# Altium project Ultra_CAP.PrjPcb
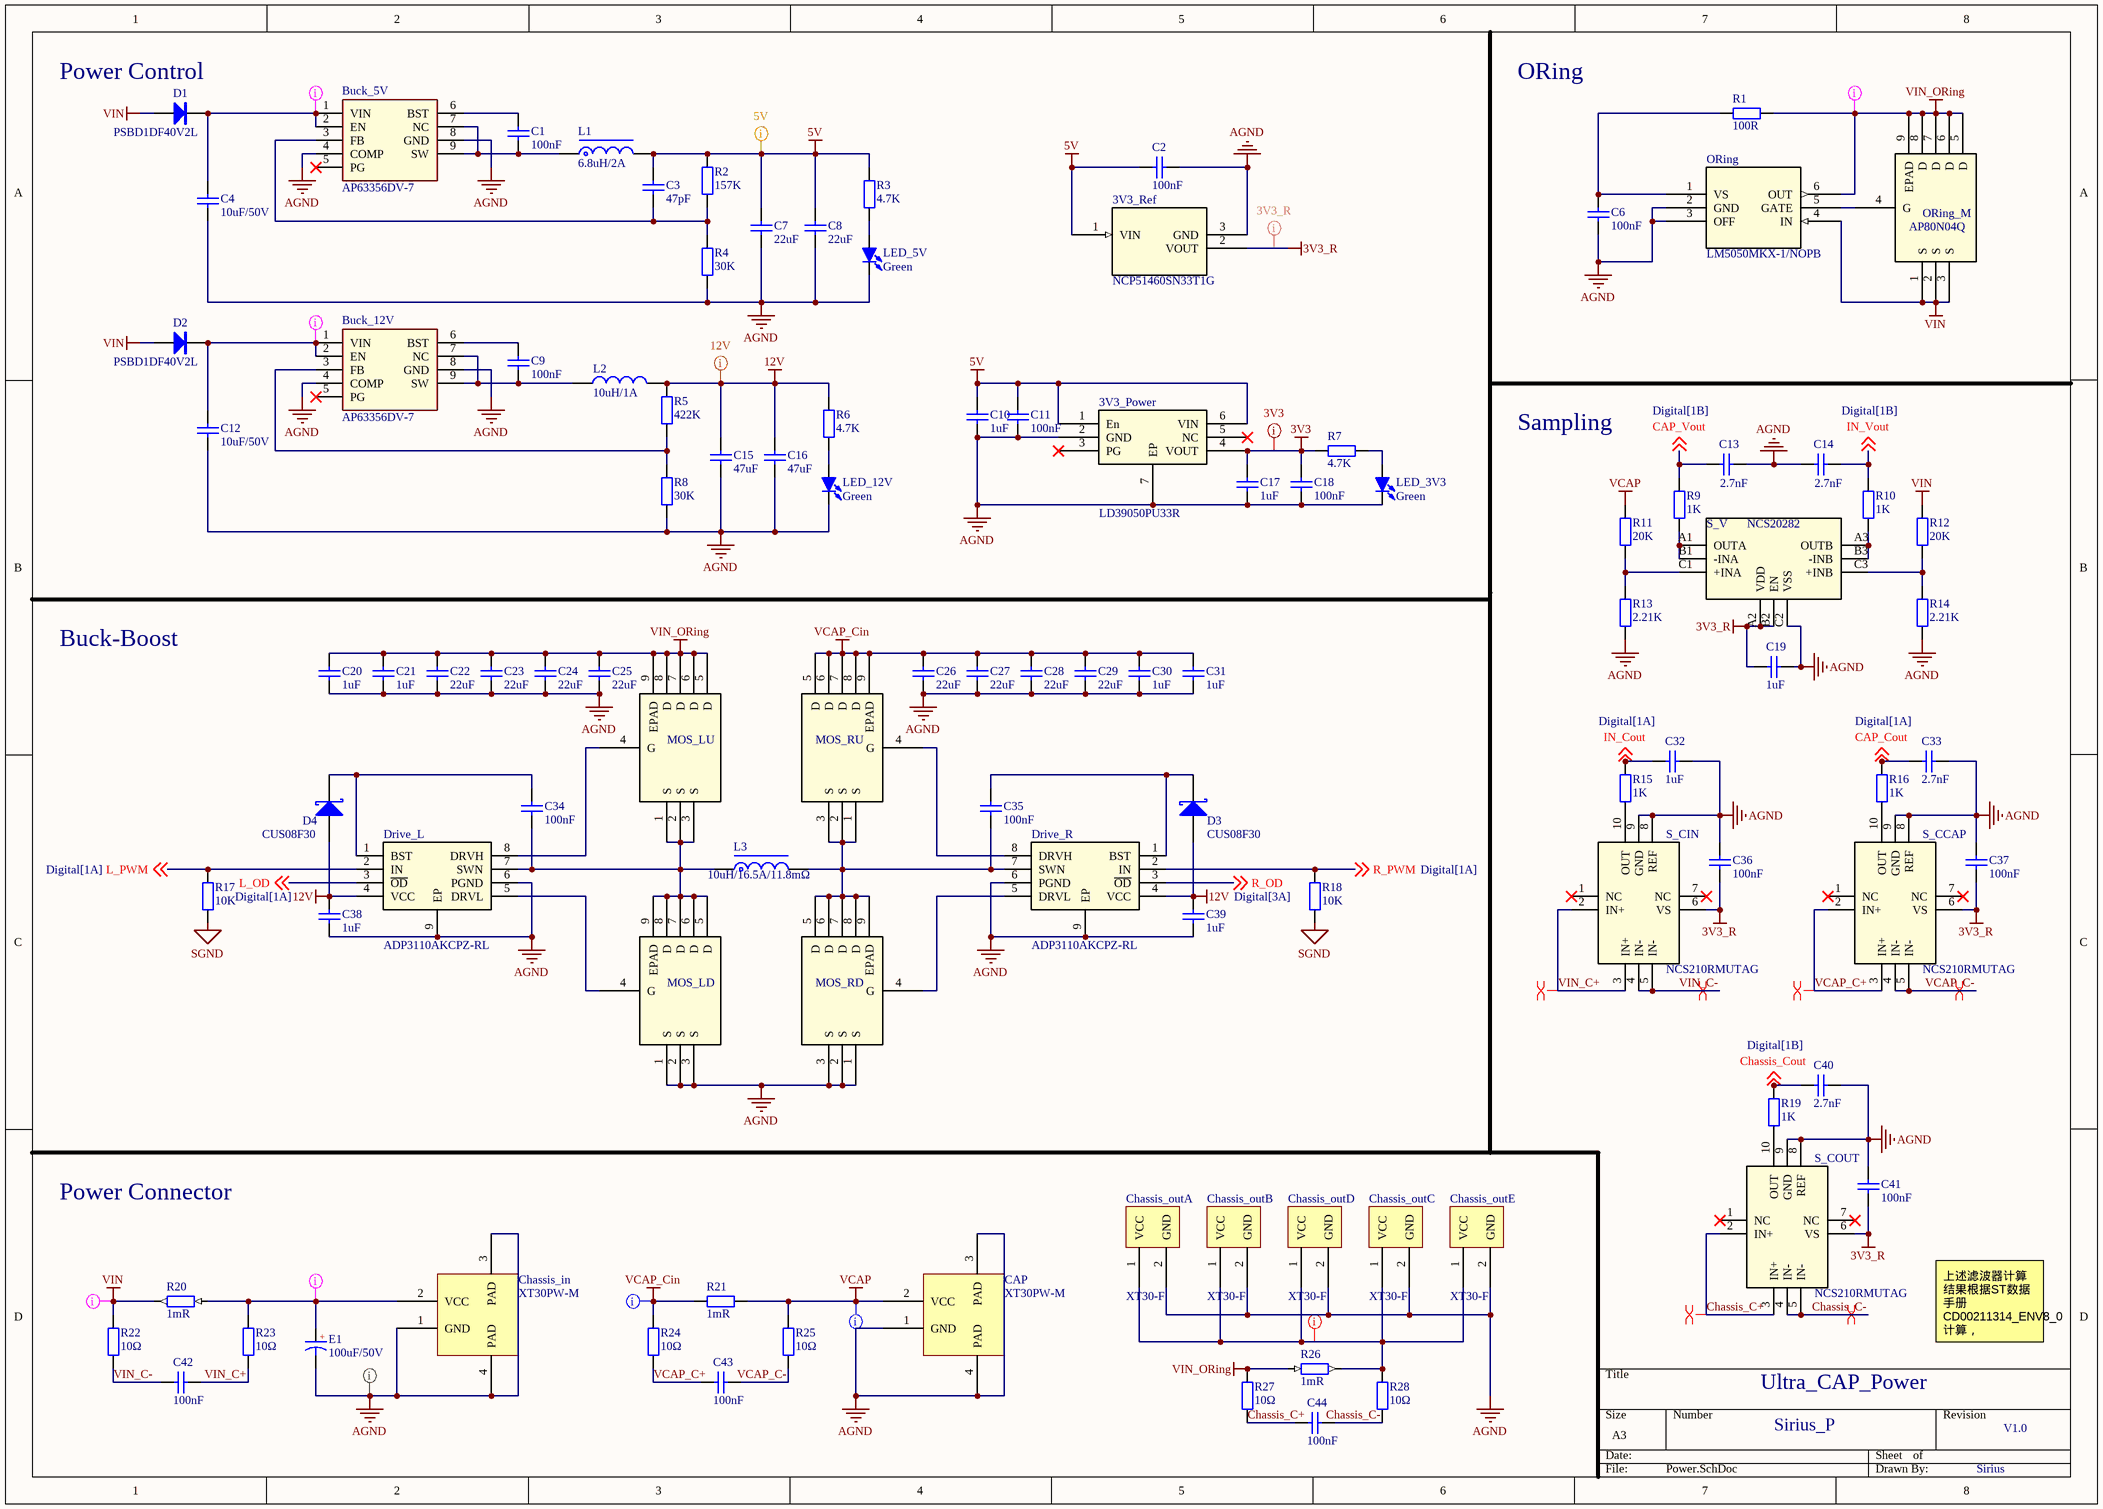
[diagram p0: Power.SchDoc]
2 sheets, 183 parts. Net scope: global (net labels, ports and power ports of the same name join across sheets).
Board file: Ultra_CAP.PcbDoc
Sheets:
  Power.SchDoc
  Digital.SchDoc

## Sheet Power.SchDoc
size A3; SheetNumber: 1; SheetTotal: 2

### Parts
3V3_Power  LD39050PU33R  [SON_DFN6_3X3_STM-L]
3V3_Ref  NCP51460SN33T1G  [SOT23]
Buck_5V  AP63356DV-7  [AP63356DV7]
Buck_12V  AP63356DV-7  [AP63356DV7]
C1  100nF  [C0603_L]
C2  100nF  [C0603_L]
C3  47pF  [C0603_L]
C4  10uF/50V  [C0603_L]
C6  100nF  [C0603_L]
C7  22uF  [C1210_L]
C8  22uF  [C1210_L]
C9  100nF  [C0603_L]
C10  1uF  [C0603_L]
C11  100nF  [C0603_L]
C12  10uF/50V  [C0603_L]
C13  2.7nF  [C0603_L]
C14  2.7nF  [C0603_L]
C15  47uF  [C1206_L]
C16  47uF  [C1206_L]
C17  1uF  [C0603_L]
C18  100nF  [C0603_L]
C19  1uF  [C0603_L]
C20  1uF  [C0603_L]
C21  1uF  [C0603_L]
C22  22uF  [C2220_no overlay]
C23  22uF  [C2220_no overlay]
C24  22uF  [C2220_no overlay]
C25  22uF  [C2220_no overlay]
C26  22uF  [C2220_no overlay]
C27  22uF  [C2220_no overlay]
C28  22uF  [C2220_no overlay]
C29  22uF  [C2220_no overlay]
C30  1uF  [C0603_L]
C31  1uF  [C0603_L]
C32  1uF  [C0603_L]
C33  2.7nF  [C0603_L]
C34  100nF  [C0603_L]
C35  100nF  [C0603_L]
C36  100nF  [C0603_L]
C37  100nF  [C0603_L]
C38  1uF  [C0603_L]
C39  1uF  [C0603_L]
C40  2.7nF  [C0603_L]
C41  100nF  [C0603_L]
C42  100nF  [C0603_L]
C43  100nF  [C0603_L]
C44  100nF  [C0603_L]
CAP  XT30PW-M  [CONN-TH_XT30PW-M]
Chassis_in  XT30PW-M  [CONN-TH_XT30PW-M]
Chassis_outA  XT30-F  [XT30-F]
Chassis_outB  XT30-F  [XT30-F]
Chassis_outC  XT30-F  [XT30-F]
Chassis_outD  XT30-F  [XT30-F]
Chassis_outE  XT30-F  [XT30-F]
D1  PSBD1DF40V2L  [SOD-123]
D2  PSBD1DF40V2L  [SOD-123]
D3  CUS08F30  [SOD-323]
D4  CUS08F30  [SOD-323]
Drive_L  ADP3110AKCPZ-RL  [SON50P300X300X100-9N]
Drive_R  ADP3110AKCPZ-RL  [SON50P300X300X100-9N]
E1  100uF/50V  [CT 3.5*8*8 - R]
L1  6.8uH/2A  [L-SMD-0420]
L2  10uH/1A  [L1210]
L3  10uH/16.5A/11.8mΩ  [INDPM176169X700N]
LED_3V3  Green  [LED0603_G]
LED_5V  Green  [LED0603_G]
LED_12V  Green  [LED0603_G]
MOS_LD  HYG025N06LS1C2  [PDFN5*6-8l]  (value not drawn)
MOS_LU  HYG025N06LS1C2  [PDFN5*6-8l]  (value not drawn)
MOS_RD  HYG025N06LS1C2  [PDFN5*6-8l]  (value not drawn)
MOS_RU  HYG025N06LS1C2  [PDFN5*6-8l]  (value not drawn)
ORing  LM5050MKX-1/NOPB  [SOT23-6]
ORing_M  AP80N04Q  [TDFN33-8]
R1  100R  [R0603_L]
R2  157K  [R0603_L]
R3  4.7K  [R0603_L]
R4  30K  [R0603_L]
R5  422K  [R0603_L]
R6  4.7K  [R0603_L]
R7  4.7K  [R0603_L]
R8  30K  [R0603_L]
R9  1K  [R0603_L]
R10  1K  [R0603_L]
R11  20K  [R0603_L]
R12  20K  [R0603_L]
R13  2.21K  [R0603_L]
R14  2.21K  [R0603_L]
R15  1K  [R0603_L]
R16  1K  [R0603_L]
R17  10K  [R0603_L]
R18  10K  [R0603_L]
R19  1K  [R0603_L]
R20  1mR  [R2512_L]
R21  1mR  [R2512_L]
R22  10Ω  [R0603_L]
R23  10Ω  [R0603_L]
R24  10Ω  [R0603_L]
R25  10Ω  [R0603_L]
R26  1mR  [R2512_L]
R27  10Ω  [R0603_L]
R28  10Ω  [R0603_L]
S_CCAP  NCS210RMUTAG  [QFN40P140X180X60-10N]
S_CIN  NCS210RMUTAG  [QFN40P140X180X60-10N]
S_COUT  NCS210RMUTAG  [QFN40P140X180X60-10N]
S_V  NCS20282  [BGA9C40P3X3_122X122X62]

### Nets
3V3: 3V3_Power.4(VOUT) C17.2 C18.2 R7.2
3V3_R: 3V3_Ref.2(VOUT) C19.2 C36.1 C37.1 C41.1 S_CCAP.6(VS) S_CIN.6(VS) S_COUT.6(VS) S_V.A2(VDD) S_V.B2(EN)
5V: 3V3_Power.1(En) 3V3_Power.6(VIN) 3V3_Ref.1(VIN) C2.2 C3.2 C7.2 C8.2 C10.2 C11.2 L1.2 R2.2 R3.2
12V: C15.2 C16.2 C38.1 C39.1 D3.1(A) D4.1(A) Drive_L.4(VCC) Drive_R.4(VCC) L2.2 R5.2 R6.2
AGND: 3V3_Power.2(GND) 3V3_Power.7(EP) 3V3_Ref.3(GND) Buck_5V.4(COMP) Buck_5V.8(GND) Buck_12V.4(COMP) Buck_12V.8(GND) C2.1 C4.1 C6.1 C7.1 C8.1 C10.1 C11.1 C12.1 C13.2 C14.1 C15.1 C16.1 C17.1 C18.1 C19.1 C20.1 C21.1 C22.1 C23.1 C24.1 C25.1 C26.1 C27.1 C28.1 C29.1 C30.1 C31.1 C32.2 C33.2 C36.2 C37.2 C38.2 C39.2 C40.2 C41.2 CAP.1(GND) CAP.3(PAD) CAP.4(PAD) Chassis_in.1(GND) Chassis_in.3(PAD) Chassis_in.4(PAD) Chassis_outA.2(GND) Chassis_outB.2(GND) Chassis_outC.2(GND) Chassis_outD.2(GND) Chassis_outE.2(GND) Drive_L.6(PGND) Drive_L.9(EP) Drive_R.6(PGND) Drive_R.9(EP) E1.2 LED_3V3.2(K) LED_5V.2(K) LED_12V.2(K) MOS_LD.1(S) MOS_LD.2(S) MOS_LD.3(S) MOS_RD.1(S) MOS_RD.2(S) MOS_RD.3(S) ORing.2(GND) ORing.3(OFF) R4.1 R8.1 R13.1 R14.1 S_CCAP.8(REF) S_CCAP.9(GND) S_CIN.8(REF) S_CIN.9(GND) S_COUT.8(REF) S_COUT.9(GND) S_V.C2(VSS)
SGND: R17.2 R18.2
VCAP: CAP.2(VCC) R11.1 R21.2 R25.2
VCAP_Cin: C26.2 C27.2 C28.2 C29.2 C30.2 C31.2 MOS_RU.5(D) MOS_RU.6(D) MOS_RU.7(D) MOS_RU.8(D) MOS_RU.9(EPAD) R21.1 R24.2
VIN: D1.1(A) D2.1(A) ORing.4(IN) ORing_M.1(S) ORing_M.2(S) ORing_M.3(S) R12.1 R20.1 R22.2
VIN_ORing: C20.2 C21.2 C22.2 C23.2 C24.2 C25.2 MOS_LU.5(D) MOS_LU.6(D) MOS_LU.7(D) MOS_LU.8(D) MOS_LU.9(EPAD) ORing.6(OUT) ORing_M.5(D) ORing_M.6(D) ORing_M.7(D) ORing_M.8(D) ORing_M.9(EPAD) R1.2 R26.1 R27.1
CAP_Cout: C33.1 R16.1 ; off-sheet CAP_Cout
CAP_Vout: C13.1 R9.1 ; off-sheet CAP_Vout
Chassis_C+: C44.2 R27.2 S_COUT.2(IN+) S_COUT.3(IN+)
Chassis_C-: C44.1 R28.1 S_COUT.4(IN-) S_COUT.5(IN-)
Chassis_Cout: C40.1 R19.1 ; off-sheet Chassis_Cout
IN_Cout: C32.1 R15.1 ; off-sheet IN_Cout
IN_Vout: C14.2 R10.1 ; off-sheet IN_Vout
L_OD: Drive_L.3(~{OD}) ; off-sheet L_OD
L_PWM: Drive_L.2(IN) R17.1 ; off-sheet L_PWM
R_OD: Drive_R.3(~{OD}) ; off-sheet R_OD
R_PWM: Drive_R.2(IN) R18.1 ; off-sheet R_PWM
VCAP_C+: C43.2 R24.1 S_CCAP.2(IN+) S_CCAP.3(IN+)
VCAP_C-: C43.1 R25.1 S_CCAP.4(IN-) S_CCAP.5(IN-)
VIN_C+: C42.1 R23.1 S_CIN.2(IN+) S_CIN.3(IN+)
VIN_C-: C42.2 R22.1 S_CIN.4(IN-) S_CIN.5(IN-)
NetBuck_5V_1: Buck_5V.1(VIN) Buck_5V.2(EN) C4.2 D1.2(K)
NetBuck_5V_3: Buck_5V.3(FB) C3.1 R2.1 R4.2
NetBuck_5V_6: Buck_5V.6(BST) C1.2
NetBuck_5V_7: Buck_5V.7(NC) Buck_5V.9(SW) C1.1 L1.1
NetBuck_12V_1: Buck_12V.1(VIN) Buck_12V.2(EN) C12.2 D2.2(K)
NetBuck_12V_3: Buck_12V.3(FB) R5.1 R8.2
NetBuck_12V_6: Buck_12V.6(BST) C9.2
NetBuck_12V_7: Buck_12V.7(NC) Buck_12V.9(SW) C9.1 L2.1
NetC6_2: C6.2 ORing.1(VS) R1.1
NetC34_1: C34.1 D4.2(K) Drive_L.1(BST)
NetC34_2: C34.2 Drive_L.7(SWN) L3.1 MOS_LD.5(D) MOS_LD.6(D) MOS_LD.7(D) MOS_LD.8(D) MOS_LD.9(EPAD) MOS_LU.1(S) MOS_LU.2(S) MOS_LU.3(S)
NetC35_1: C35.1 D3.2(K) Drive_R.1(BST)
NetC35_2: C35.2 Drive_R.7(SWN) L3.2 MOS_RD.5(D) MOS_RD.6(D) MOS_RD.7(D) MOS_RD.8(D) MOS_RD.9(EPAD) MOS_RU.1(S) MOS_RU.2(S) MOS_RU.3(S)
NetChassis_in_2: Chassis_in.2(VCC) E1.1 R20.2 R23.2
NetChassis_outA_1: Chassis_outA.1(VCC) Chassis_outB.1(VCC) Chassis_outC.1(VCC) Chassis_outD.1(VCC) Chassis_outE.1(VCC) R26.2 R28.2
NetDrive_L_5: Drive_L.5(DRVL) MOS_LD.4(G)
NetDrive_L_8: Drive_L.8(DRVH) MOS_LU.4(G)
NetDrive_R_5: Drive_R.5(DRVL) MOS_RD.4(G)
NetDrive_R_8: Drive_R.8(DRVH) MOS_RU.4(G)
NetLED_3V3_1: LED_3V3.1(A) R7.1
NetLED_5V_1: LED_5V.1(A) R3.1
NetLED_12V_1: LED_12V.1(A) R6.1
NetORing_5: ORing.5(GATE) ORing_M.4(G)
NetR9_2: R9.2 S_V.A1(OUTA) S_V.B1(-INA)
NetR10_2: R10.2 S_V.A3(OUTB) S_V.B3(-INB)
NetR11_2: R11.2 R13.2 S_V.C1(+INA)
NetR12_2: R12.2 R14.2 S_V.C3(+INB)
NetR15_2: R15.2 S_CIN.10(OUT)
NetR16_2: R16.2 S_CCAP.10(OUT)
NetR19_2: R19.2 S_COUT.10(OUT)

Not connected (* = marked no-connect by the designer): 3V3_Power 3(PG)* 5(NC)*; Buck_5V 5(PG)*; Buck_12V 5(PG)*; S_CCAP 1(NC)* 7(NC)*; S_CIN 1(NC)* 7(NC)*; S_COUT 1(NC)* 7(NC)*

### Layout directives
rule Supply Nets [Voltage = 5.000]; net class Power_Class: 5V
rule Supply Nets [Voltage = 3.300]; net class Power_Class: 3V3, 3V3_R
rule Supply Nets [Voltage = 0.000]; net class Power_Class: AGND
rule Supply Nets [Voltage = 24.00]; net class Power_Class: NetBuck_5V_1, NetBuck_12V_1, NetChassis_in_2, VIN, VIN_ORing
rule Supply Nets [Voltage = 23.50]; net class Power_Class: VCAP, VCAP_Cin
rule Supply Nets [Voltage = 12.00]; net class Power_Class: 12V
differential pair: Chassis_C+, Chassis_C-, VCAP_C+, VCAP_C-, VIN_C+, VIN_C-
net class Power_Class: NetChassis_outA_1

### Notes on the sheet
- (near D1) Power Control
- ORing
- Sampling
- Buck-Boost
- Power Connector
- Ultra_CAP_Power
- 上述滤波器计算结果根据ST数据手册CD00211314_ENV8_0计算，FAINmax=37kHz
- Sirius_P
- V1.0
- Sirius
- (in symbol CS) +

### Library data of the parts
3V3_Power = LD39050PU33R: LDO-3V3/500mA
3V3_Ref = NCP51460SN33T1G: 基准电压源3V3; Mfr_Name: onsemi; Copyright: Copyright (C) 2022 Ultra Librarian. All rights reserved.; Manufacturer_Part_Number: NCP51460SN33T1G; RefDes: RefDes; Type: DEV
Buck_5V Buck_12V = AP63356DV-7: Switching Voltage Regulators DCDC Conv HV Buck V-DFN3020-13 T&R 3K 3.8V TO 32V INPUT, 3.5A LOW IQ SYNCHRONOUS BUCK WITH ENHANCED EMI REDUCTION; Manufacturer_Name: Diodes Inc.; Geometry.Height: 0.85mm; Mouser Part Number: 621-AP63356DV-7; Mouser Price/Stock: https://www.mouser.co.uk/ProductDetail/Diodes-Incorporated/AP63356DV-7?qs=bZr6mbWTK5k9UirUfdvjSw%3D%3D; Manufacturer_Part_Number: AP63356DV-7; Datasheet Link: https://www.diodes.com/assets/Datasheets/AP63356-AP63357.pdf
C1-C4 C6-C44 = C: 贴片电容; BOM名称: 无极性贴片电容; 联系卖家，免费查找封装: 唯一出售店铺网址https://shop463601444.taobao.com
D1 D2 = 1N5822: 肖特基二极管; 联系卖家，免费查找封装: 唯一出售店铺网址https://shop463601444.taobao.com; BOM名称: 肖特基二极管
D3 D4 = 1N5819: 肖特基二极管; 联系卖家，免费查找封装: 唯一出售店铺网址https://shop463601444.taobao.com; BOM名称: 肖特基二极管
Drive_L Drive_R = ADP3110AKCPZ-RL: ON SEMICONDUCTOR - ADP3110AKCPZ-RL - MOSFET Driver, High Side And Low Side, 4.6V-13.2V Supply, 1A Out, 20ns Delay, DFN-8; Manufacturer_Name: onsemi; Geometry.Height: 1mm; Manufacturer_Part_Number: ADP3110AKCPZ-RL; Mouser Part Number: 863-ADP3110AKCPZ-RL; Mouser Price/Stock: https://www.mouser.co.uk/ProductDetail/ON-Semiconductor/ADP3110AKCPZ-RL?qs=t2BMfLoP1KSx%2FvThl35SBw%3D%3D; Arrow Part Number: ADP3110AKCPZ-RL; Arrow Price/Stock: https://www.arrow.com/en/products/adp3110akcpz-rl/on-semiconductor; Mouser Testing Part Number: *; Mouser Testing Price/Stock: *; Datasheet Link: http://www.onsemi.com/pub/Collateral/ADP3110A-D.PDF
E1 = CS: 直插固态电容; 联系卖家，免费查找封装: 唯一出售店铺网址https://shop463601444.taobao.com; BOM名称: 直插固态电容
L1 = L-Molding Choke: 一体成型电感; 联系卖家，免费查找封装: 唯一出售店铺网址https://shop463601444.taobao.com; BOM名称: 一体成型电感
L2 = L: 贴片小功率电感; BOM名称: 小功率贴片电感; 联系卖家，免费查找封装: 唯一出售店铺网址https://shop463601444.taobao.com
L3 = L-Molding Choke: 一体成型电感 / TMPC1707HP-100MG-D; 联系卖家，免费查找封装: 唯一出售店铺网址https://shop463601444.taobao.com; BOM名称: 一体成型电感
LED_3V3 LED_5V LED_12V = LED-SMD: 贴片LED; 联系卖家 免费查找封装: 封装库来自淘宝卖家ID：黄晶宝石; BOM名称: 贴片LED
MOS_LD MOS_LU MOS_RD MOS_RU = HYG025N06LS1C2: NMOS 60V/170A; Mfr_Name: Alpha and Omega Semiconductor; Manufacturer_Part_Number: AON7418; Copyright: Copyright (C) 2022 Ultra Librarian. All rights reserved.; RefDes: RefDes; Type: DEV
ORing = LM5050MKX-1/NOPB: 理想二极管控制器; Mfr_Name: Texas Instruments; Copyright: Copyright (C) 2022 Ultra Librarian. All rights reserved.; Manufacturer_Part_Number: LM5050MKX-1/NOPB; RefDes: RefDes; Type: DEV
ORing_M = AP80N04Q: Trans MOSFET N-CH 40V 40A 8-Pin PDFN EP T/R; Manufacturer_Name: Taiwan Semiconductor; Manufacturer_Part_Number: TSM085P03CV RGG; Geometry.Height: 0.75mm; Mouser Part Number: 821-TSM085P03CVRGG; Mouser Price/Stock: https://www.mouser.co.uk/ProductDetail/Taiwan-Semiconductor/TSM085P03CV-RGG?qs=4pzlT8jjbhd4XXSAn%252BJ6qw%3D%3D; Arrow Part Number: TSM085P03CV RGG; Arrow Price/Stock: https://www.arrow.com/en/products/tsm085p03cvrgg/taiwan-semiconductor; Mouser Testing Part Number: *; Mouser Testing Price/Stock: *; Datasheet Link: https://componentsearchengine.com/Datasheets/1/TSM085P03CV RGG.pdf
R1-R28 = R: 贴片电阻; 联系卖家，免费查找封装: 唯一出售店铺网址https://shop463601444.taobao.com; BOM名称: 贴片电阻
S_CCAP S_CIN S_COUT = NCS210RMUTAG: CURRENT SENSE AMP G=200; Manufacturer_Name: onsemi; Geometry.Height: 0.6mm; Manufacturer_Part_Number: NCS210RMUTAG; Mouser Part Number: 863-NCS210RMUTAG; Mouser Price/Stock: https://www.mouser.co.uk/ProductDetail/ON-Semiconductor/NCS210RMUTAG?qs=lYGu3FyN48dPWsNmv2BxUw%3D%3D; Arrow Part Number: NCS210RMUTAG; Arrow Price/Stock: https://www.arrow.com/en/products/ncs210rmutag/on-semiconductor?region=nac; Mouser Testing Part Number: *; Mouser Testing Price/Stock: *; Datasheet Link: http://www.onsemi.com/pub/Collateral/NCS210R-D.PDF
S_V = NCS20282: 7 MHz, 125 A Low Power Operational Amplifier; Manufacturer_Name: onsemi; Manufacturer_Part_Number: FAN48610UC50X; Geometry.Height: 0.619mm; Mouser Part Number: 512-FAN48610UC50X; Mouser Price/Stock: https://www.mouser.co.uk/ProductDetail/ON-Semiconductor-Fairchild/FAN48610UC50X?qs=3SGS%2FGl3GGz6Cj18V%2F7jcA%3D%3D; Arrow Part Number: FAN48610UC50X; Arrow Price/Stock: https://www.arrow.com/en/products/fan48610uc50x/on-semiconductor?region=nac; Mouser Testing Part Number: *; Mouser Testing Price/Stock: *; Datasheet Link: https://www.onsemi.com/pub/Collateral/FAN48610-D.pdf

## Sheet Digital.SchDoc
size A3; SheetNumber: 2; SheetTotal: 2
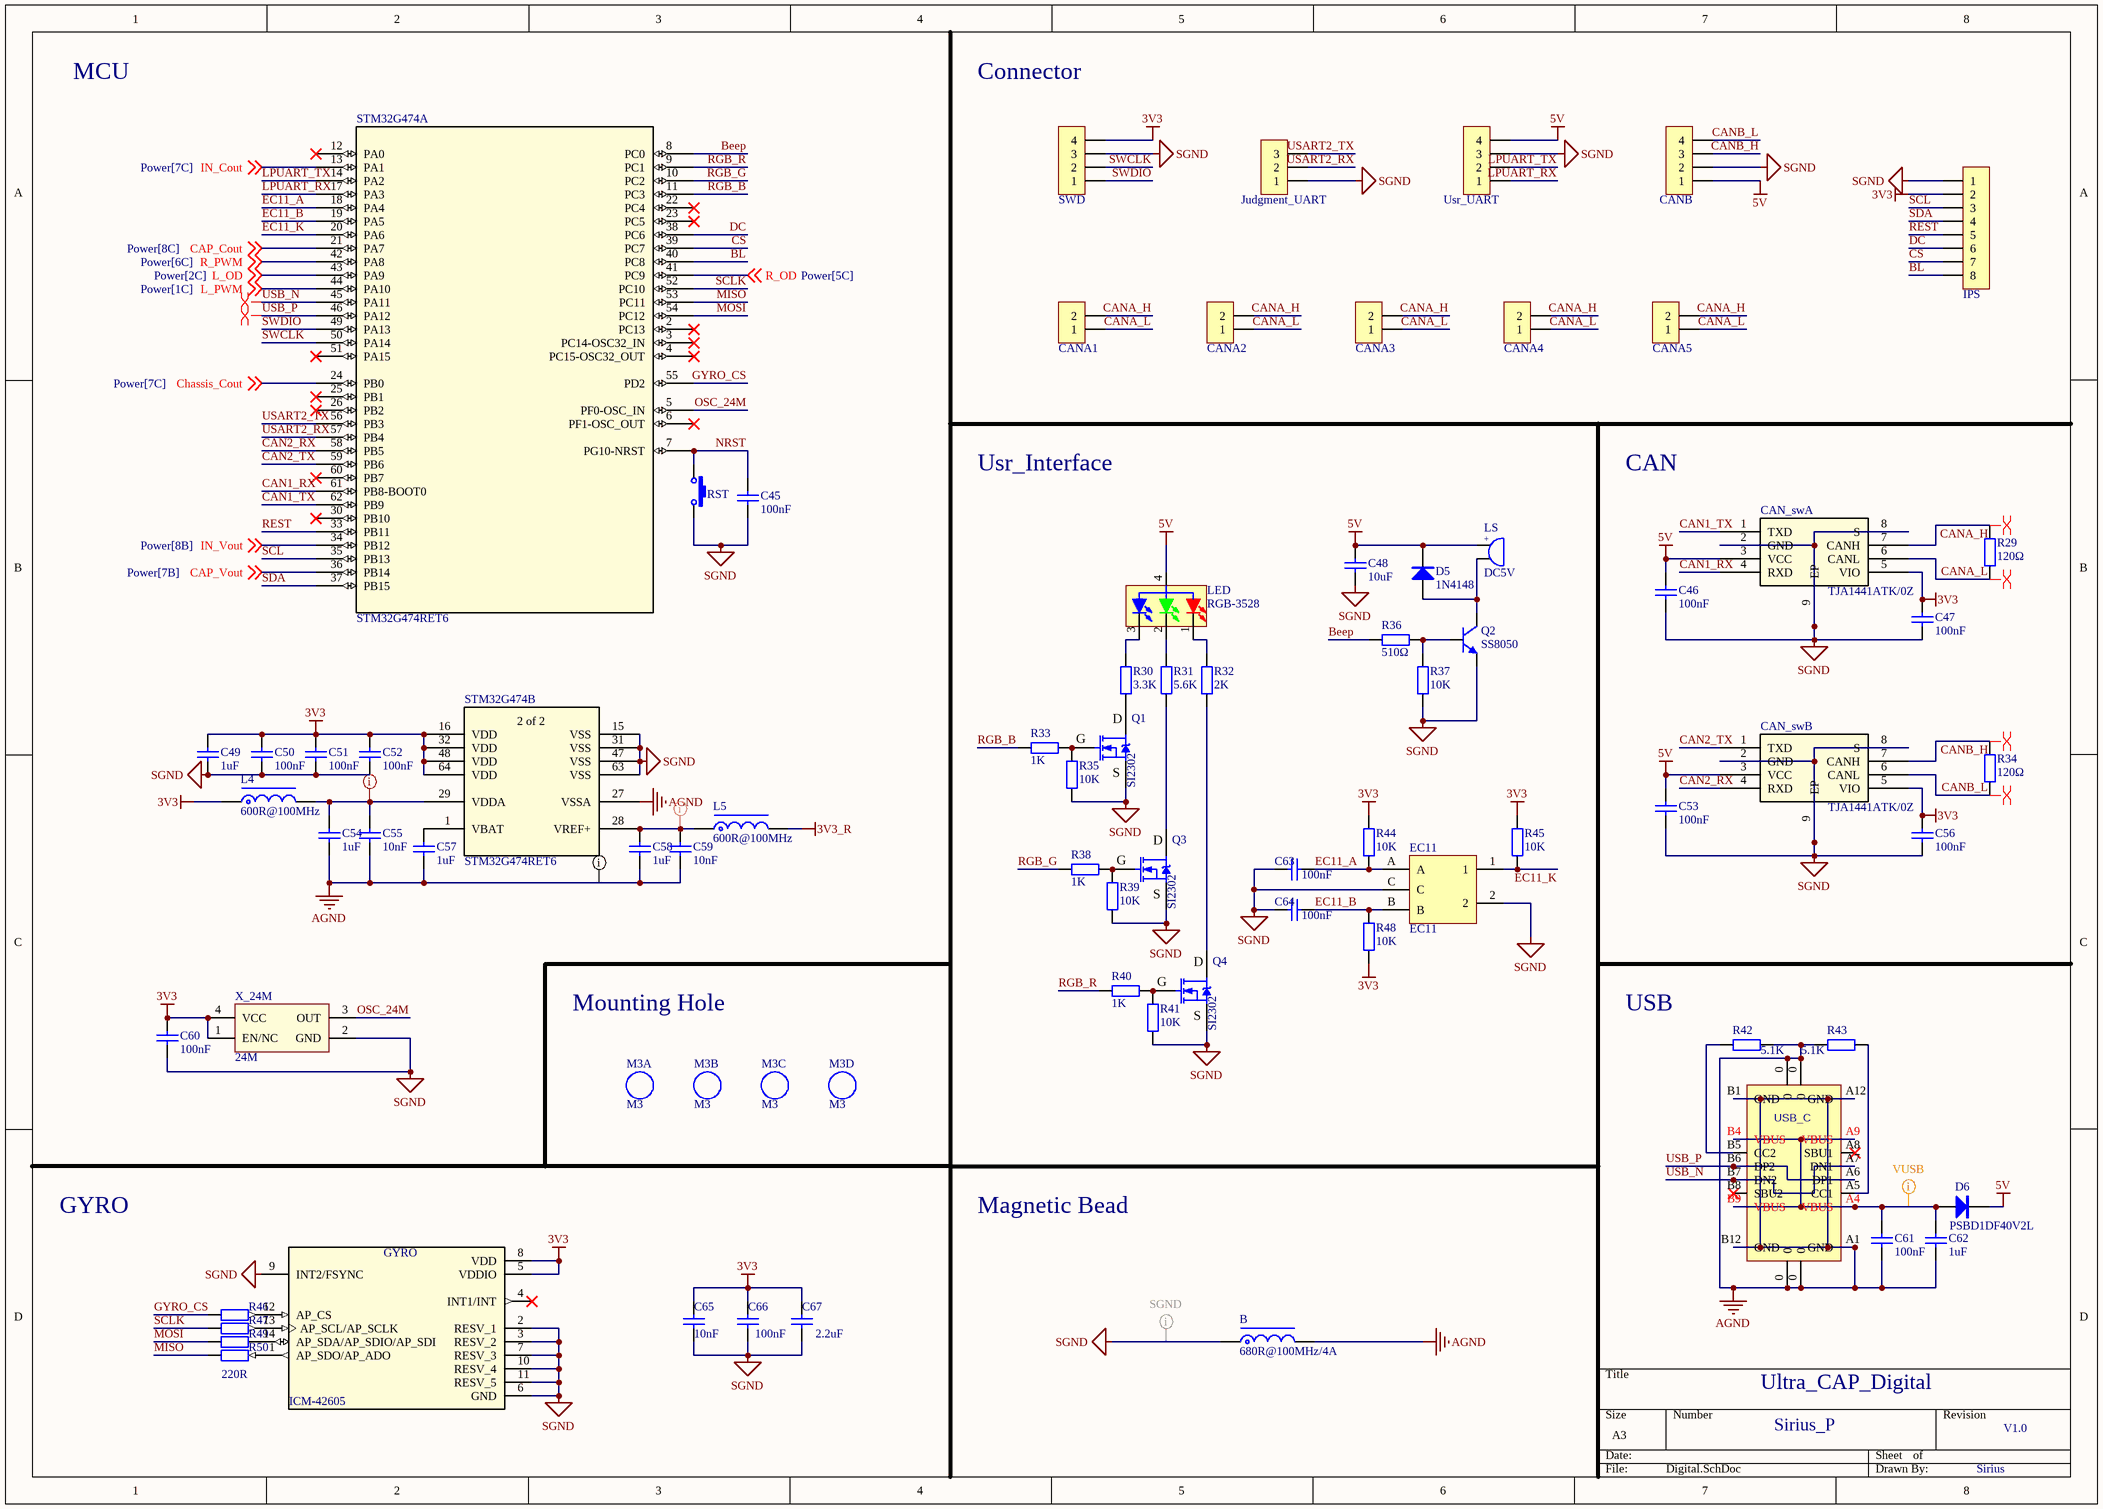
[diagram p1: Digital.SchDoc]

### Parts
B  680R@100MHz/4A  [R1812_L]
C45  100nF  [C0603_L]
C46  100nF  [C0603_L]
C47  100nF  [C0603_L]
C48  10uF  [C0603_L]
C49  1uF  [C0603_L]
C50  100nF  [C0603_L]
C51  100nF  [C0603_L]
C52  100nF  [C0603_L]
C53  100nF  [C0603_L]
C54  1uF  [C0603_L]
C55  10nF  [C0603_L]
C56  100nF  [C0603_L]
C57  1uF  [C0603_L]
C58  1uF  [C0603_L]
C59  10nF  [C0603_L]
C60  100nF  [C0603_L]
C61  100nF  [C0603_L]
C62  1uF  [C0603_L]
C63  100nF  [C0603_L]
C64  100nF  [C0603_L]
C65  10nF  [C0603_L]
C66  100nF  [C0603_L]
C67  2.2uF  [C0603_L]
CAN_swA  TJA1441ATK/0Z  [SON65P300X300X100-9N-D]
CAN_swB  TJA1441ATK/0Z  [SON65P300X300X100-9N-D]
CANA1  HDR-1X2  [CONN-SMD_2P-P1.25_JUSHUO_GH125-S02DCA-00]  (value not drawn)
CANA2  HDR-1X2  [CONN-SMD_2P-P1.25_JUSHUO_GH125-S02DCA-00]  (value not drawn)
CANA3  HDR-1X2  [CONN-SMD_2P-P1.25_JUSHUO_GH125-S02DCA-00]  (value not drawn)
CANA4  HDR-1X2  [CONN-SMD_2P-P1.25_JUSHUO_GH125-S02DCA-00]  (value not drawn)
CANA5  HDR-1X2  [CONN-SMD_2P-P1.25_JUSHUO_GH125-S02DCA-00]  (value not drawn)
CANB  HDR-1X4  [CONN-SMD_4P-P1.27_GH125-S04DCA-00]  (value not drawn)
D5  1N4148  [SOD-323]
D6  PSBD1DF40V2L  [SOD-123]
EC11  EC11  [EC11]
GYRO  ICM-42605  [PQFN50P300X250X97-14N - duplicate]
IPS  HDR-1X8  [HDR2.54-M-LI-8P]  (value not drawn)
Judgment_UART  HDR-1X3  [CONN-SMD_3P-P1.25_JUSHUO_GH125-S03DCA-00]  (value not drawn)
L4  600R@100MHz  [R0603_L]
L5  600R@100MHz  [R0603_L]
LED  RGB-3528  [LED 3528-4Pin]
LS  DC5V  [BEEP 5x9x5.5]
M3A  M3  [M3 125X200]
M3B  M3  [M3 125X200]
M3C  M3  [M3 125X200]
M3D  M3  [M3 125X200]
Q1  SI2302  [SOT23-3N]
Q2  SS8050  [SOT23-3N]
Q3  SI2302  [SOT23-3N]
Q4  SI2302  [SOT23-3N]
R29  120Ω  [R0603_L]
R30  3.3K  [R0603_L]
R31  5.6K  [R0603_L]
R32  2K  [R0603_L]
R33  1K  [R0603_L]
R34  120Ω  [R0603_L]
R35  10K  [R0603_L]
R36  510Ω  [R0603_L]
R37  10K  [R0603_L]
R38  1K  [R0603_L]
R39  10K  [R0603_L]
R40  1K  [R0603_L]
R41  10K  [R0603_L]
R42  5.1K  [R0603_L]
R43  5.1K  [R0603_L]
R44  10K  [R0603_L]
R45  10K  [R0603_L]
R46  220R  [R0603_L]
R47  220R  [R0603_L]  (value not drawn)
R48  10K  [R0603_L]
R49  220R  [R0603_L]  (value not drawn)
R50  220R  [R0603_L]  (value not drawn)
RST  3x6x5  [SW SMD-3*6*5]  (value not drawn)
STM32G474  STM32G474RET6  [LQFP64-10*10]  (parts A,B of 2)
SWD  HDR-1X4  [MX1.25-WS-4P]  (value not drawn)
USB_C  TYPE-C 2.0 -16P  [USB-C-SMD_16P]  (value not drawn)
Usr_UART  HDR-1X4  [CONN-SMD_4P-P1.27_GH125-S04DCA-00]  (value not drawn)
X_24M  24M  [OSC-2025-4P]

### Nets
3V3: C47.2 C49.2 C50.2 C51.2 C52.1 C56.2 C60.2 C65.2 C66.2 C67.2 CAN_swA.5(VIO) CAN_swB.5(VIO) GYRO.5(VDDIO) GYRO.8(VDD) IPS.2 L4.1 R44.1 R45.1 R48.2 STM32G474.16(VDD) STM32G474.32(VDD) STM32G474.48(VDD) STM32G474.64(VDD) SWD.4 X_24M.1(EN/NC) X_24M.4(VCC)
3V3_R: L5.2
5V: C46.2 C48.2 C53.2 CAN_swA.3(VCC) CAN_swB.3(VCC) CANB.1 D5.2(K) D6.2(K) LED.4(A) LS.1 Usr_UART.4
AGND: B.2 C54.1 C55.1 C57.1 C58.1 C59.1 C61.1 C62.1 R42.2 R43.1 STM32G474.27(VSSA) USB_C.0 USB_C.A1(GND) USB_C.A12(GND) USB_C.B1(GND) USB_C.B12(GND)
SGND: B.1 C45.1 C46.1 C47.1 C48.1 C49.1 C50.1 C51.1 C52.2 C53.1 C56.1 C60.1 C63.1 C64.1 C65.1 C66.1 C67.1 CAN_swA.2(GND) CAN_swA.8(S) CAN_swA.9(EP) CAN_swB.2(GND) CAN_swB.8(S) CAN_swB.9(EP) CANB.2 EC11.2 EC11.C GYRO.2(RESV_1) GYRO.3(RESV_2) GYRO.6(GND) GYRO.7(RESV_3) GYRO.9(INT2/FSYNC) GYRO.10(RESV_4) GYRO.11(RESV_5) IPS.1 Judgment_UART.1 Q1.2(S) Q2.2(E) Q3.2(S) Q4.2(S) R35.2 R37.2 R39.2 R41.2 RST.2 STM32G474.15(VSS) STM32G474.31(VSS) STM32G474.47(VSS) STM32G474.63(VSS) SWD.3 Usr_UART.3 X_24M.2(GND)
Beep: R36.2 STM32G474.8(PC0)
BL: IPS.8 STM32G474.40(PC8)
CAN1_RX: CAN_swA.4(RXD) STM32G474.61(PB8-BOOT0)
CAN1_TX: CAN_swA.1(TXD) STM32G474.62(PB9)
CAN2_RX: CAN_swB.4(RXD) STM32G474.58(PB5)
CAN2_TX: CAN_swB.1(TXD) STM32G474.59(PB6)
CANA_H: CAN_swA.7(CANH) CANA1.2 CANA2.2 CANA3.2 CANA4.2 CANA5.2 R29.2
CANA_L: CAN_swA.6(CANL) CANA1.1 CANA2.1 CANA3.1 CANA4.1 CANA5.1 R29.1
CANB_H: CAN_swB.7(CANH) CANB.3 R34.2
CANB_L: CAN_swB.6(CANL) CANB.4 R34.1
CAP_Cout: STM32G474.21(PA7) ; off-sheet CAP_Cout
CAP_Vout: STM32G474.36(PB14) ; off-sheet CAP_Vout
Chassis_Cout: STM32G474.24(PB0) ; off-sheet Chassis_Cout
CS: IPS.7 STM32G474.39(PC7)
DC: IPS.6 STM32G474.38(PC6)
EC11_A: C63.2 EC11.A R44.2 STM32G474.18(PA4)
EC11_B: C64.2 EC11.B R48.1 STM32G474.19(PA5)
EC11_K: EC11.1 R45.2 STM32G474.20(PA6)
GYRO_CS: R46.1 STM32G474.55(PD2)
IN_Cout: STM32G474.13(PA1) ; off-sheet IN_Cout
IN_Vout: STM32G474.34(PB12) ; off-sheet IN_Vout
L_OD: STM32G474.43(PA9) ; off-sheet L_OD
L_PWM: STM32G474.44(PA10) ; off-sheet L_PWM
LPUART_RX: STM32G474.17(PA3) Usr_UART.1
LPUART_TX: STM32G474.14(PA2) Usr_UART.2
MISO: R50.1 STM32G474.53(PC11)
MOSI: R49.1 STM32G474.54(PC12)
NRST: C45.2 RST.1 STM32G474.7(PG10-NRST)
OSC_24M: STM32G474.5(PF0-OSC_IN) X_24M.3(OUT)
R_OD: STM32G474.41(PC9) ; off-sheet R_OD
R_PWM: STM32G474.42(PA8) ; off-sheet R_PWM
REST: IPS.5 STM32G474.33(PB11)
RGB_B: R33.2 STM32G474.11(PC3)
RGB_G: R38.2 STM32G474.10(PC2)
RGB_R: R40.2 STM32G474.9(PC1)
SCL: IPS.3 STM32G474.35(PB13)
SCLK: R47.1 STM32G474.52(PC10)
SDA: IPS.4 STM32G474.37(PB15)
SWCLK: STM32G474.50(PA14) SWD.2
SWDIO: STM32G474.49(PA13) SWD.1
USART2_RX: Judgment_UART.2 STM32G474.57(PB4)
USART2_TX: Judgment_UART.3 STM32G474.56(PB3)
USB_N: STM32G474.45(PA11) USB_C.A7(DN1) USB_C.B7(DN2)
USB_P: STM32G474.46(PA12) USB_C.A6(DP1) USB_C.B6(DP2)
NetC54_2: C54.2 C55.2 L4.2 STM32G474.29(VDDA)
NetC57_2: C57.2 STM32G474.1(VBAT)
NetC58_2: C58.2 C59.2 L5.1 STM32G474.28(VREF+)
NetC61_2: C61.2 C62.2 D6.1(A) USB_C.A4(VBUS) USB_C.A9(VBUS) USB_C.B4(VBUS) USB_C.B9(VBUS)
NetD5_1: D5.1(A) LS.2 Q2.3(C)
NetGYRO_1: GYRO.1(AP_SDO/AP_ADO) R50.2
NetGYRO_12: GYRO.12(AP_CS) R46.2
NetGYRO_13: GYRO.13(AP_SCL/AP_SCLK) R47.2
NetGYRO_14: GYRO.14(AP_SDA/AP_SDIO/AP_SDI) R49.2
NetLED_1: LED.1(RED_K) R32.2
NetLED_2: LED.2(GREEN_K) R31.2
NetLED_3: LED.3(BULE_K) R30.2
NetQ1_1: Q1.1(G) R33.1 R35.1
NetQ1_3: Q1.3(D) R30.1
NetQ2_1: Q2.1(B) R36.1 R37.1
NetQ3_1: Q3.1(G) R38.1 R39.1
NetQ3_3: Q3.3(D) R31.1
NetQ4_1: Q4.1(G) R40.1 R41.1
NetQ4_3: Q4.3(D) R32.1
NetR42_1: R42.1 USB_C.B5(CC2)
NetR43_2: R43.2 USB_C.A5(CC1)

Not connected (* = marked no-connect by the designer): GYRO 4(INT1/INT)*; STM32G474 2(PC13)* 3(PC14-OSC32_IN)* 4(PC15-OSC32_OUT)* 6(PF1-OSC_OUT)* 12(PA0)* 22(PC4)* 23(PC5)* 25(PB1)* 26(PB2)* 30(PB10)* 51(PA15)* 60(PB7)*; USB_C A8(SBU1)* B8(SBU2)*

### Layout directives
differential pair; rule Signal Stimulus [Kind - Periodic Pulse    Level - High    Start Time = 0.000    Stop Time = 41.67n    Period Time = 83.33n]: USB_N, USB_P
differential pair: CANA_H, CANA_L, CANB_H, CANB_L
net class Power_Class; rule Supply Nets [Voltage = 5.000]: NetC61_2
rule Supply Nets [Voltage = 3.300]; net class Power_Class: NetC54_2, NetC58_2
rule Supply Nets [Voltage = 0.000]; net class Power_Class: AGND, SGND

### Notes on the sheet
- MCU
- Connector
- Usr_Interface
- CAN
- Mounting Hole
- USB
- GYRO
- Magnetic Bead
- Ultra_CAP_Digital
- Sirius_P
- V1.0
- Sirius
- (in symbol BEEP) +
- (in symbol STM32G474RET6, part B) 2 of 2

### Library data of the parts
B L4 L5 = FB: 磁珠; BOM名称: 直插磁珠; 联系卖家，免费查找封装: 唯一出售店铺网址https://shop463601444.taobao.com
C45-C64 = C: as C1 on sheet Power
C65 = C: VDDIO滤波电容; BOM名称: 无极性贴片电容; 联系卖家，免费查找封装: 唯一出售店铺网址https://shop463601444.taobao.com
C66 C67 = C: VDD滤波电容; BOM名称: 无极性贴片电容; 联系卖家，免费查找封装: 唯一出售店铺网址https://shop463601444.taobao.com
CAN_swA CAN_swB = TJA1441ATK/0Z: CAN电平转换芯片; Mfr_Name: NXP; Manufacturer_Part_Number: TJA1441BTK/0Z; Copyright: Copyright (C) 2022 Ultra Librarian. All rights reserved.; RefDes: RefDes; Type: DEV
CANA1-CANA5 = Header 2: 2P连接器; 联系卖家，免费技术支持: 唯一出售店铺网址https://shop463601444.taobao.com; 联系卖家 免费技术支持: 封装库来自淘宝卖家ID：黄晶宝石; BOM名称: 2P连接器
CANB SWD Usr_UART = Header 4: 4P连接器; 联系卖家，免费技术支持: 唯一出售店铺网址https://shop463601444.taobao.com; 联系卖家 免费技术支持: 封装库来自淘宝卖家ID：黄晶宝石; BOM名称: 4P连接器
D5 = 1N4148: 开关二极管; BOM名称: 高速开关二极管; 联系卖家，免费查找封装: 唯一出售店铺网址https://shop463601444.taobao.com
D6 = 1N5822: as D1 on sheet Power; BOM名称: 肖特基二极管
EC11 = EC11: 数字开关编码器; BOM名称: 数字编码开关; 联系卖家，免费查找封装: 唯一出售店铺网址https://shop463601444.taobao.com; 封装库来自淘宝卖家ID：黄晶宝石: 其他店铺购入均为盗版假冒封装库，请立即申请退款
GYRO = ICM-42605: Accelerometer, Gyroscope, 6 Axis Sensor IÂ²C, I3Câ„ , SPI Output; MF: TDK InvenSense; Value: *; MP: ICM-42605; Package: - TDK InvenSense; SnapEDA_Link: https://www.snapeda.com/parts/ICM-42605/TDK%20InvenSense/view-part/3226540/?ref=snap; Digi-Key_Part_Number: 1428-1152-1-ND; Digi-Key_Purchase_URL: https://www.digikey.com.cn/product-detail/zh/tdk-invensense/ICM-42605/1428-1152-1-ND/9953675?utm_source=snapeda&utm_medium=aggregator&utm_campaign=symbol
IPS = Header 8: 8P接插件; 封装库来自淘宝卖家 ID：黄晶宝石: 其他店铺购入均为盗版假冒封装库; 联系卖家，免费查找封装: 唯一出售店铺网址https://shop463601444.taobao.com; BOM名称: 8P接插件
Judgment_UART = Header 3: 3P连接器; 联系卖家，免费技术支持: 唯一出售店铺网址https://shop463601444.taobao.com; 联系卖家 免费技术支持: 封装库来自淘宝卖家ID：黄晶宝石; BOM名称: 3P连接器
LED = LED-RGB 3528: 3528三基色LED; BOM名称: 三基色LED; 联系卖家 免费查找封装: 封装库来自淘宝卖家ID：黄晶宝石
LS = BEEP: 蜂鸣器; 联系卖家，免费查找封装: 唯一出售店铺网址https://shop463601444.taobao.com; 封装库来自淘宝卖家ID：黄晶宝石: 其他店铺购入均为盗版假冒封装库，请立即申请退款; BOM名称: 蜂鸣器
M3A M3B M3C M3D = M3: 铜柱孔; 联系卖家，免费查找封装: 唯一出售店铺网址https://shop463601444.taobao.com; 封装库来自淘宝卖家ID：黄晶宝石: 其他店铺购入均为盗版假冒封装库，请立即申请退款; BOM名称: 铜柱孔
Q1 Q3 Q4 = AO3400: N沟道 20V/6A; BOM名称: 场效应管; 联系卖家，免费查找封装: 唯一出售店铺网址https://shop463601444.taobao.com; 参数: N沟道 30V/4.2A
Q2 = 8050-SMD: 高频放大-NPN型; 联系卖家，免费查找封装: 唯一出售店铺网址https://shop463601444.taobao.com; 参数: 40V 1.5A 1W 100MHZ; BOM名称: 高频放大-NPN型
R29-R50 = R: as R1 on sheet Power; BOM名称: 贴片电阻
RST = SW 3x6: 3x6轻触开关; 联系卖家，免费查找封装: 唯一出售店铺网址https://shop463601444.taobao.com; 封装库来自淘宝卖家ID：黄晶宝石: 其他店铺购入均为盗版假冒封装库，请立即申请退款; BOM名称: 3x6轻触开关
STM32G474 = STM32G474RET6: MCU; Mfr_Name: STMicroelectronics; Copyright: Copyright (C) 2022 Ultra Librarian. All rights reserved.; Manufacturer_Part_Number: STM32G474RET6; RefDes: RefDes; Type: DEV
USB_C = USB2.0_Type-C_16Pin: USB2.0 Type-C 16Pin  母座; 联系卖家，免费技术支持: 唯一出售店铺网址https://shop463601444.taobao.com
X_24M = XTAL-ACT-4P: 4脚有源晶振(振荡器); 联系卖家，免费查找封装: 唯一出售店铺网址https://shop463601444.taobao.com; BOM名称: 有源晶振(振荡器)

## Nets that join several sheets
3V3: Power (3V3_Power.4 C17.2 C18.2 R7.2), Digital (26 pins)
3V3_R: Power (10 pins), Digital (L5.2)
5V: Power (12 pins), Digital (11 pins)
AGND: Power (80 pins), Digital (16 pins)
SGND: Power (R17.2 R18.2), Digital (51 pins)
CAP_Cout: Power (C33.1 R16.1), Digital (STM32G474.21)
CAP_Vout: Power (C13.1 R9.1), Digital (STM32G474.36)
Chassis_Cout: Power (C40.1 R19.1), Digital (STM32G474.24)
IN_Cout: Power (C32.1 R15.1), Digital (STM32G474.13)
IN_Vout: Power (C14.2 R10.1), Digital (STM32G474.34)
L_OD: Power (Drive_L.3), Digital (STM32G474.43)
L_PWM: Power (Drive_L.2 R17.1), Digital (STM32G474.44)
R_OD: Power (Drive_R.3), Digital (STM32G474.41)
R_PWM: Power (Drive_R.2 R18.1), Digital (STM32G474.42)